# EAGLE schematic LED-DRIVER (EAGLE 7.5.0)
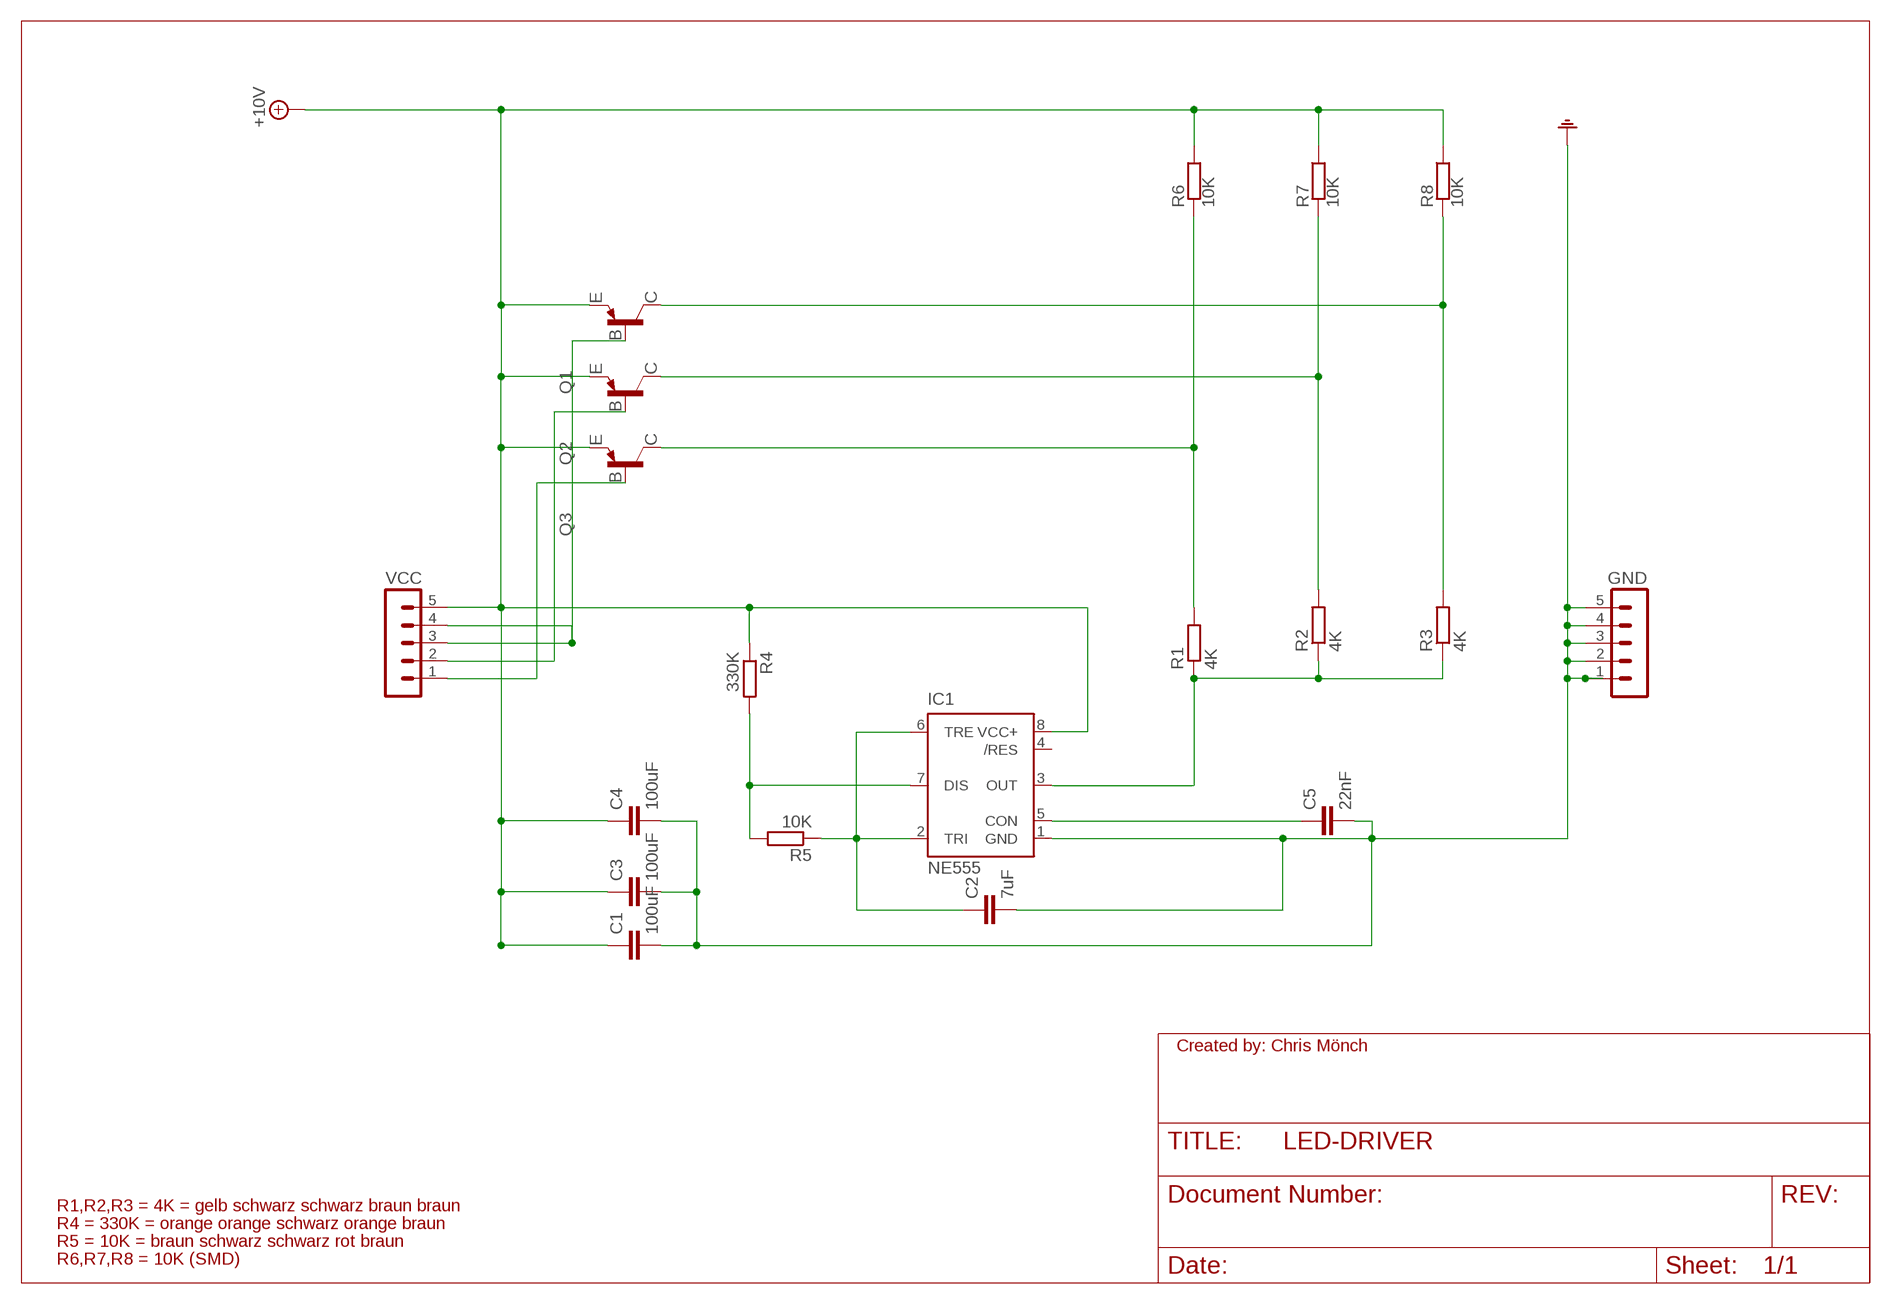
[diagram p0: schematic, sheet 1]

## Parts
C1  100uF  C2,5-3  [C2.5-3]
C2  7uF  C2,5-3  [C2.5-3]
C3  100uF  C2,5-3  [C2.5-3]
C4  100uF  C2,5-3  [C2.5-3]
C5  22nF  C2,5-3  [C2.5-3]
GND  MA05-1  [MA05-1]
IC1  NE555  [DIL-08]
Q1  2N3906MMBT  [SOT-23]
Q2  2N3906MMBT  [SOT-23]
Q3  2N3906MMBT  [SOT-23]
R1  4K  R-EU_0204/5  [0204/5]
R2  4K  R-EU_0204/5  [0204/5]
R3  4K  R-EU_0204/5  [0204/5]
R4  330K  R-EU_0204/5  [0204/5]
R5  10K  R-EU_0204/5  [0204/5]
R6  10K  SMS-0  [SMS-0]
R7  10K  SMS-0  [SMS-0]
R8  10K  SMS-0  [SMS-0]
U$1  GND  [PWR]
VCC  MA05-1  [MA05-1]

## Nets
+10V: C1.1 C3.1 C4.1 IC1.8(VCC+) Q1.2(E) Q2.2(E) Q3.2(E) R4.1 R6.1 R7.1 R8.1 VCC.5
GND: C1.2 C2.2 C3.2 C4.2 C5.2 GND.1 GND.2 GND.3 GND.4 GND.5 IC1.1(GND) U$1.P$1
N$1: Q2.1(C) R2.2 R7.2
N$2: Q1.3(B) VCC.3 VCC.4
N$3: Q2.3(B) VCC.2
N$4: Q3.3(B) VCC.1
N$5: Q1.1(C) R3.2 R8.2
N$6: Q3.1(C) R1.2 R6.2
N$7: IC1.7(DIS) R4.2 R5.2
N$8: C2.1 IC1.2(TRI) IC1.6(TRE) R5.1
N$9: C5.1 IC1.5(CON)
N$10: IC1.3(OUT) R1.1 R2.1 R3.1
Unconnected: IC1.4(/RES)

## Notes on the sheet
- Created by: Chris Mönch
- R1,R2,R3 = 4K = gelb schwarz schwarz braun braun
- R4 = 330K = orange orange schwarz orange braun
- R5 = 10K = braun schwarz schwarz rot braun
- R6,R7,R8 = 10K (SMD)

## Library data of the parts
C1-C5 = capacitor-wima:C: CAPACITOR naming: grid - package width
GND VCC = con-lstb:MA05-1: PIN HEADER; OC_FARNELL: unknown; OC_NEWARK: unknown
IC1 = HElicopterLib:NE555: General purpose bipolar Timer; MF: Arrow Electronics; MPN: NE555N; OC_FARNELL: 1467742; OC_NEWARK: 89K1486
Q1-Q3 = bt_transistor:2N3906: PNP Transistor Small signal PNP Bipolar Junction Transistor (BJT). Use this device to represent any of a number of such transistors with similar package and pinout: 2N4402, 2N3906, etc.
R1-R5 = rcl:R-EU_: RESISTOR, European symbol
R6-R8 = resistor-shunt:SMS-0: SMD SHUNT RESISTOR; OC_FARNELL: unknown; OC_NEWARK: unknown
U$1 = bt_automotive:GND